# Altium schematic sheet Sht1-BlockDiagram.SchDoc
size A; SheetNumber: 1; SheetTotal: 4
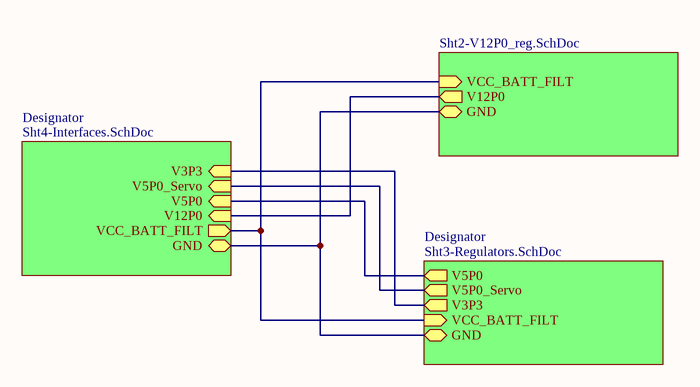
[diagram p0: Sht1-BlockDiagram.SchDoc]

## Sub-sheets
Designator = Sht4-Interfaces.SchDoc: VCC_BATT_FILT (out), V12P0 (in), V5P0 (in), V5P0_Servo (in), V3P3 (in), GND (bidir)
Designator = Sht3-Regulators.SchDoc: V5P0 (out), V5P0_Servo (out), V3P3 (out), VCC_BATT_FILT (in), GND (bidir)
? = Sht2-V12P0_reg.SchDoc: VCC_BATT_FILT (in), V12P0 (out), GND (bidir)

## Nets
(unnamed): sheet Designator/VCC_BATT_FILT, sheet /VCC_BATT_FILT, sheet Designator/VCC_BATT_FILT
(unnamed): sheet Designator/V12P0, sheet /V12P0
(unnamed): sheet Designator/V5P0, sheet Designator/V5P0
(unnamed): sheet Designator/V5P0_Servo, sheet Designator/V5P0_Servo
(unnamed): sheet Designator/V3P3, sheet Designator/V3P3
(unnamed): sheet Designator/GND, sheet /GND, sheet Designator/GND